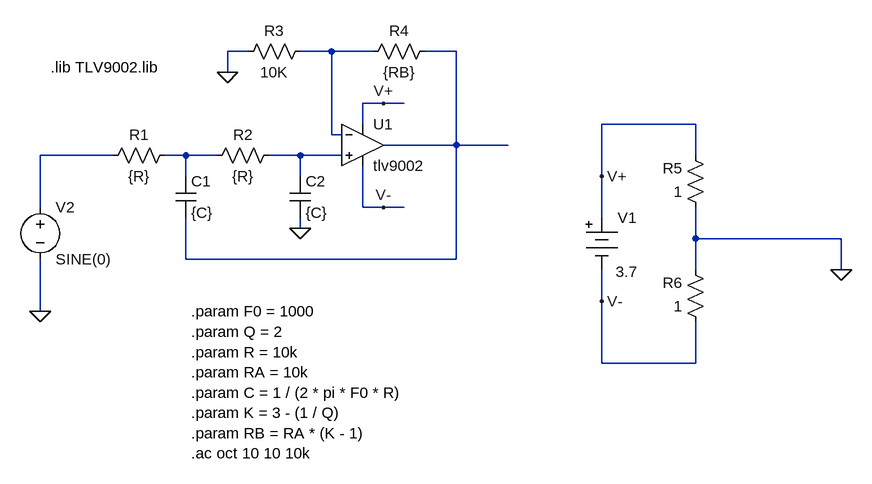
[diagram p0: schematic Draft1.asc]
Draft1.asc, the LTspice schematic file:
Version 4
SHEET 1 1064 680
WIRE 128 -32 96 -32
WIRE 256 -32 208 -32
WIRE 320 -32 256 -32
WIRE 448 -32 400 -32
WIRE 96 0 96 -32
WIRE 336 48 304 48
WIRE 368 48 336 48
WIRE 304 80 304 48
WIRE 816 80 672 80
WIRE 256 96 256 -32
WIRE 272 96 256 96
WIRE 448 112 448 -32
WIRE 448 112 336 112
WIRE 528 112 448 112
WIRE -80 128 -192 128
WIRE 32 128 0 128
WIRE 80 128 32 128
WIRE 208 128 160 128
WIRE 272 128 208 128
WIRE 816 128 816 80
WIRE 32 160 32 128
WIRE 208 160 208 128
WIRE 672 160 672 80
WIRE -192 208 -192 128
WIRE 304 208 304 144
WIRE 336 208 304 208
WIRE 368 208 336 208
WIRE 672 224 672 160
WIRE 208 240 208 224
WIRE 816 256 816 208
WIRE 1040 256 816 256
WIRE 32 288 32 224
WIRE 448 288 448 112
WIRE 448 288 32 288
WIRE 816 304 816 256
WIRE 1040 304 1040 256
WIRE 672 352 672 304
WIRE -192 368 -192 288
WIRE 672 448 672 352
WIRE 816 448 816 384
WIRE 816 448 672 448
FLAG 208 240 0
FLAG 336 48 V+
FLAG 336 208 V-
FLAG 96 0 0
FLAG 672 160 V+
FLAG 672 352 V-
FLAG 1040 304 0
FLAG -192 368 0
SYMBOL Opamps/opamp2 304 48 R0
SYMATTR InstName U1
SYMATTR Value tlv9002
SYMBOL res 16 112 R90
WINDOW 0 0 56 VBottom 2
WINDOW 3 32 56 VTop 2
SYMATTR InstName R1
SYMATTR Value {R}
SYMBOL res 176 112 R90
WINDOW 0 0 56 VBottom 2
WINDOW 3 32 56 VTop 2
SYMATTR InstName R2
SYMATTR Value {R}
SYMBOL cap 16 160 R0
SYMATTR InstName C1
SYMATTR Value {C}
SYMBOL cap 192 160 R0
SYMATTR InstName C2
SYMATTR Value {C}
SYMBOL res 224 -48 R90
WINDOW 0 0 56 VBottom 2
WINDOW 3 32 56 VTop 2
SYMATTR InstName R3
SYMATTR Value 10K
SYMBOL res 416 -48 R90
WINDOW 0 0 56 VBottom 2
WINDOW 3 32 56 VTop 2
SYMATTR InstName R4
SYMATTR Value {RB}
SYMBOL Misc/battery 672 208 R0
WINDOW 3 21 99 Left 2
SYMATTR Value 3.7
SYMATTR InstName V1
SYMBOL res 832 224 R180
WINDOW 0 36 76 Left 2
WINDOW 3 36 40 Left 2
SYMATTR InstName R5
SYMATTR Value 1
SYMBOL res 832 400 R180
WINDOW 0 36 76 Left 2
WINDOW 3 36 40 Left 2
SYMATTR InstName R6
SYMATTR Value 1
SYMBOL voltage -192 192 R0
SYMATTR InstName V2
SYMATTR Value SINE(0)
SYMATTR Value2 AC 1
TEXT 40 368 Left 2 !.param F0 = 1000\n.param Q = 2\n.param R = 10k\n.param RA = 10k\n.param C = 1 / (2 * pi * F0 * R)\n.param K = 3 - (1 / Q)\n.param RB = RA * (K - 1)\n.ac oct 10 10 10k
TEXT -176 -8 Left 2 !.lib TLV9002.lib

The netlist it stands for:
* Draft1.asc
XU1 N005 N001 V+ V- N002 tlv9002  ; pins In+ In- V+ V- OUT
R1 N004 N003 {R}
R2 N005 N004 {R}
C1 N004 N002 {C}
C2 N005 0 {C}
R3 N001 0 10K
R4 N002 N001 {RB}
V1 V+ V- 3.7
R5 0 V+ 1
R6 V- 0 1
V2 N003 0 SINE(0) AC 1
.param F0 = 1000
.param Q = 2
.param R = 10k
.param RA = 10k
.param C = 1 / (2 * pi * F0 * R)
.param K = 3 - (1 / Q)
.param RB = RA * (K - 1)
.ac oct 10 10 10k
.lib TLV9002.lib
.backanno
.end